# Altium schematic sheet 秒信号发生器.SchDoc: 秒信号发生器
size A4
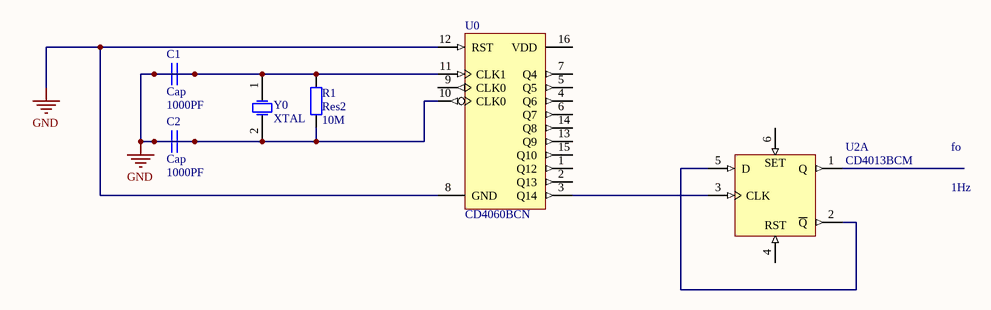
[diagram p0: 秒信号发生器.SchDoc]

## Parts
C1  Cap  value 1000PF  [RAD-0.3]
C2  Cap  value 1000PF  [RAD-0.3]
R1  Res2  value 10M  [AXIAL-0.4]
U0  CD4060BCN  [N16E]
U2  CD4013BCM  [M14A_N]  (part A of 2)
Y0  XTAL  [R38]

## Nets
GND: C1.1 C1.2 C2.1 C2.2 R1.1 R1.2 U0.8(GND) U0.10(CLK0) U0.11(CLK1) U0.12(RST) U2.7(GND) Y0.1(OSC1) Y0.2(OSC2)
VDD: U2.14(VDD)
NetU0_3: U0.3(Q14) U2.3(CLK)
NetU2_2: U2.2(~{Q}) U2.5(D)

Not connected (* = marked no-connect by the designer): U0 1(Q12) 2(Q13) 4(Q6) 5(Q5) 6(Q7) 7(Q4) 9(CLK0) 13(Q9) 14(Q8) 15(Q10) 16(VDD); U2 1(Q) 4(RST) 6(S)

## Notes on the sheet
- fo
- 1Hz
- (in symbol CD4013BCM, part A) SET

## Library data of the parts
C1 C2 = Cap: Capacitor; Published: 8-Jun-2000; LatestRevisionDate: 17-Jul-2002; LatestRevisionNote: Re-released for DXP Platform.; PackageReference: RAD-0.3; Publisher: Altium Limited; PackageDescription: Radial Cap, Thru-Hole; 2 Leads; 0.3 in Pin Spacing
R1 = Res2: Resistor; Published: 8-Jun-2000; LatestRevisionDate: 17-Jul-2002; LatestRevisionNote: Re-released for DXP Platform.; PackageReference: AXIAL-0.4; Publisher: Altium Limited; PackageDescription: Axial Device, Thru-Hole; 2 Leads; 0.4 in Pin Spacing
U0 = CD4060BCN: 14-Stage Ripple Carry Binary Counter; Published: 15-Apr-2002; LatestRevisionDate: 06-Jun-2005; LatestRevisionNote: Stylized 3D Model Added.; DatasheetVersion: Jan-1999; PackageVersion: 2000; PackageReference: N16E; Publisher: Altium Limited; PackageDescription: DIP; 16 Leads; Row Spacing 7.62 mm; Pitch 2.54 mm; ComponentLink1Description: Manufacturer Link; ComponentLink1URL: http://www.national.com/; ComponentLink2Description: Datasheet; ComponentLink2URL: http://www.national.com/ds.cgi/CD/CD4020BC.pdf; ComponentLink3Description: URL Link1; ComponentLink3URL: http://www.national.com/pf/CD/CD4060BM.html
U2 = CD4013BCM: Dual D-Type Flip-Flop; Published: 17-Jul-2002; LatestRevisionDate: 13-Apr-2006; LatestRevisionNote: IPC-7351 Footprint Added.; DatasheetVersion: Jan-1999; PackageVersion: 2000; PackageReference: M14A; Publisher: Altium Limited; PackageDescription: 14-Pin Small Outline Integrated Circuit 1.27 mm Pitch; Code_IPC: SOIC127P600-14; ComponentLink1Description: Manufacturer Link; ComponentLink1URL: http://www.fairchildsemi.com/
Y0 = XTAL: Crystal Oscillator; Published: 8-Jun-2000; LatestRevisionDate: 17-Jul-2002; LatestRevisionNote: Re-released for DXP Platform.; PackageReference: R38; Publisher: Altium Limited; PackageDescription: Crystal, Thru-Hole; 2 Leads; Body 3.1 x 8.2 mm (Dia.xH)